# Altium schematic sheet INVERTER.SchDoc
size B; CompanyName: Microchip Technology Inc.; Organization: Microchip Technology; Address1: 2355 West Chandler Blvd.; Address2: Chandler, AZ  85224; Address4: USA; DocumentNumber: 2; SheetNumber: 2; SheetTotal: 3; SheetTitle: MOSFET DRIVER + INVERTER; Time: Time
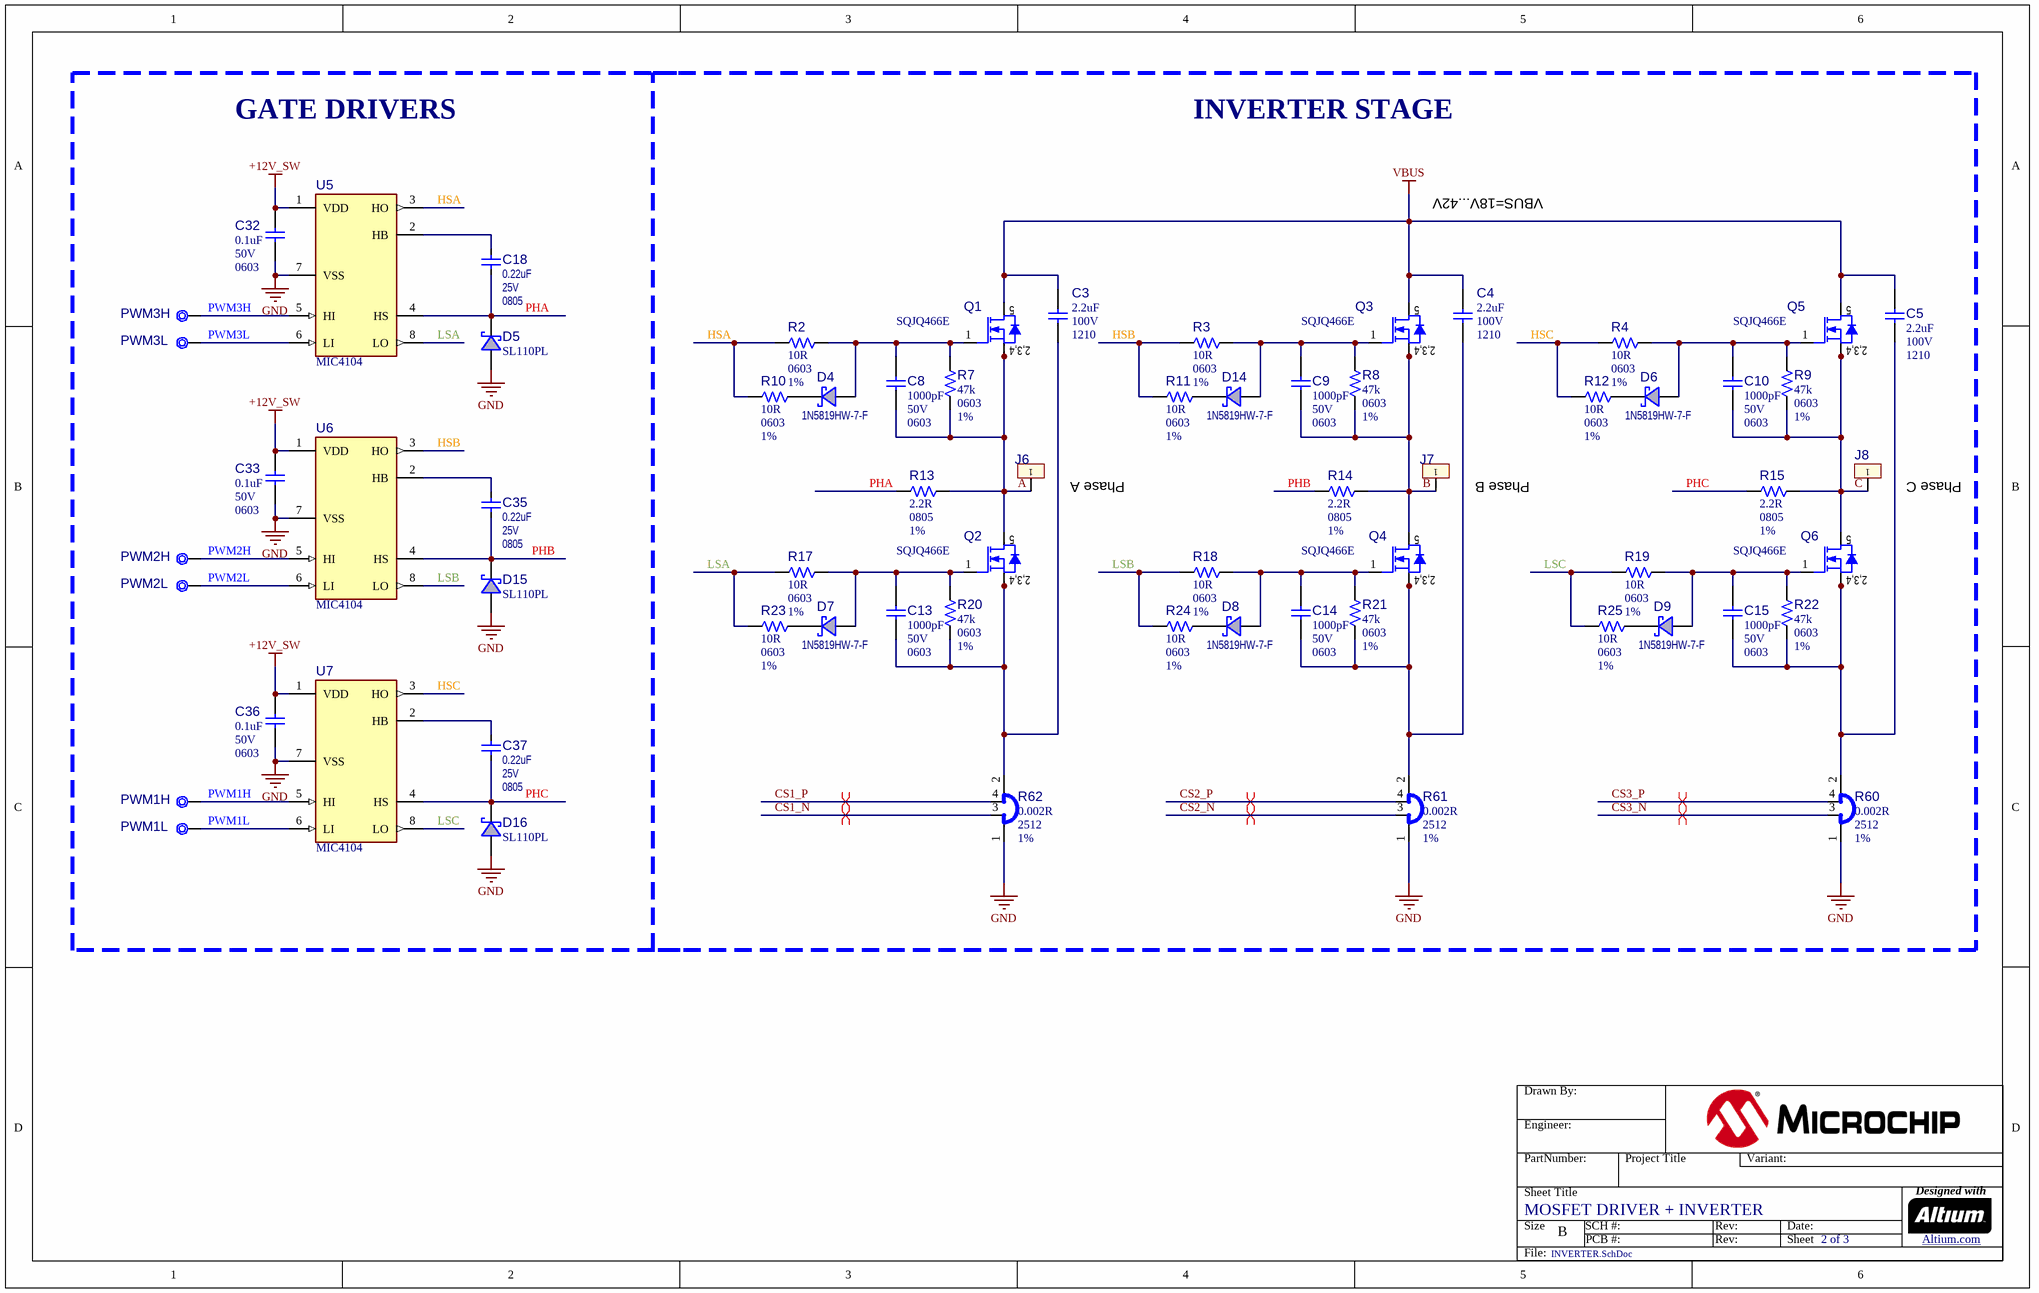
[diagram p0: INVERTER.SchDoc]

## Parts
?  (no value)  (graphical)
C3  value 2.2uF  Voltage: 100V  Package: 1210  [CAP_C_1210]  (hidden comment: Capacitor NP)
C4  value 2.2uF  Voltage: 100V  Package: 1210  [CAP_C_1210]  (hidden comment: Capacitor NP)
C5  value 2.2uF  Voltage: 100V  Package: 1210  [CAP_C_1210]  (hidden comment: Capacitor NP)
C8  value 1000pF  Voltage: 50V  Package: 0603  [CAP_C_0603]  (hidden comment: Capacitor NP)
C9  value 1000pF  Voltage: 50V  Package: 0603  [CAP_C_0603]  (hidden comment: Capacitor NP)
C10  value 1000pF  Voltage: 50V  Package: 0603  [CAP_C_0603]  (hidden comment: Capacitor NP)
C13  value 1000pF  Voltage: 50V  Package: 0603  [CAP_C_0603]  (hidden comment: Capacitor NP)
C14  value 1000pF  Voltage: 50V  Package: 0603  [CAP_C_0603]  (hidden comment: Capacitor NP)
C15  value 1000pF  Voltage: 50V  Package: 0603  [CAP_C_0603]  (hidden comment: Capacitor NP)
C18  value 0.22uF  Voltage: 25V  Package: 0805  [CAP_C_0805]  (hidden comment: Capacitor NP)
C32  value 0.1uF  Voltage: 50V  Package: 0603  [CAP_C_0603]  (hidden comment: Capacitor NP)
C33  value 0.1uF  Voltage: 50V  Package: 0603  [CAP_C_0603]  (hidden comment: Capacitor NP)
C35  value 0.22uF  Voltage: 25V  Package: 0805  [CAP_C_0805]  (hidden comment: Capacitor NP)
C36  value 0.1uF  Voltage: 50V  Package: 0603  [CAP_C_0603]  (hidden comment: Capacitor NP)
C37  value 0.22uF  Voltage: 25V  Package: 0805  [CAP_C_0805]  (hidden comment: Capacitor NP)
D4  value 1N5819HW-7-F  [SOD-123]  (hidden comment: Diode Schottky)
D5  value SL110PL  [SOD-123FL]  (hidden comment: Diode Schottky)
D6  value 1N5819HW-7-F  [SOD-123]  (hidden comment: Diode Schottky)
D7  value 1N5819HW-7-F  [SOD-123]  (hidden comment: Diode Schottky)
D8  value 1N5819HW-7-F  [SOD-123]  (hidden comment: Diode Schottky)
D9  value 1N5819HW-7-F  [SOD-123]  (hidden comment: Diode Schottky)
D14  value 1N5819HW-7-F  [SOD-123]  (hidden comment: Diode Schottky)
D15  value SL110PL  [SOD-123FL]  (hidden comment: Diode Schottky)
D16  value SL110PL  [SOD-123FL]  (hidden comment: Diode Schottky)
J6  Header 1x1  [CON_M_1x1_5.08_QC_TAB_SPADE_0.250_V]  (value not drawn)
J7  Header 1x1  [CON_M_1x1_5.08_QC_TAB_SPADE_0.250_V]  (value not drawn)
J8  Header 1x1  [CON_M_1x1_5.08_QC_TAB_SPADE_0.250_V]  (value not drawn)
PWM1H  Test Point No BOM  [TP_1.2x0.7]  (value not drawn)  (no BOM)
PWM1L  Test Point No BOM  [TP_1.2x0.7]  (value not drawn)  (no BOM)
PWM2H  Test Point No BOM  [TP_1.2x0.7]  (value not drawn)  (no BOM)
PWM2L  Test Point No BOM  [TP_1.2x0.7]  (value not drawn)  (no BOM)
PWM3H  Test Point No BOM  [TP_1.2x0.7]  (value not drawn)  (no BOM)
PWM3L  Test Point No BOM  [TP_1.2x0.7]  (value not drawn)  (no BOM)
Q1  value SQJQ466E  [PPAK_SO-8L_8x8_ALTERNATE]  (hidden comment: Transistor MOS-N GSSSD)
Q2  value SQJQ466E  [PPAK_SO-8L_8x8_ALTERNATE]  (hidden comment: Transistor MOS-N GSSSD)
Q3  value SQJQ466E  [PPAK_SO-8L_8x8_ALTERNATE]  (hidden comment: Transistor MOS-N GSSSD)
Q4  value SQJQ466E  [PPAK_SO-8L_8x8_ALTERNATE]  (hidden comment: Transistor MOS-N GSSSD)
Q5  value SQJQ466E  [PPAK_SO-8L_8x8_ALTERNATE]  (hidden comment: Transistor MOS-N GSSSD)
Q6  value SQJQ466E  [PPAK_SO-8L_8x8_ALTERNATE]  (hidden comment: Transistor MOS-N GSSSD)
R2  value 10R  Package: 0603  Tolerance: 1%  [RES_C_0603]  (hidden comment: Resistor)
R3  value 10R  Package: 0603  Tolerance: 1%  [RES_C_0603]  (hidden comment: Resistor)
R4  value 10R  Package: 0603  Tolerance: 1%  [RES_C_0603]  (hidden comment: Resistor)
R7  value 47k  Package: 0603  Tolerance: 1%  [RES_C_0603]  (hidden comment: Resistor)
R8  value 47k  Package: 0603  Tolerance: 1%  [RES_C_0603]  (hidden comment: Resistor)
R9  value 47k  Package: 0603  Tolerance: 1%  [RES_C_0603]  (hidden comment: Resistor)
R10  value 10R  Package: 0603  Tolerance: 1%  [RES_C_0603]  (hidden comment: Resistor)
R11  value 10R  Package: 0603  Tolerance: 1%  [RES_C_0603]  (hidden comment: Resistor)
R12  value 10R  Package: 0603  Tolerance: 1%  [RES_C_0603]  (hidden comment: Resistor)
R13  value 2.2R  Package: 0805  Tolerance: 1%  [RES_C_0805]  (hidden comment: Resistor)
R14  value 2.2R  Package: 0805  Tolerance: 1%  [RES_C_0805]  (hidden comment: Resistor)
R15  value 2.2R  Package: 0805  Tolerance: 1%  [RES_C_0805]  (hidden comment: Resistor)
R17  value 10R  Package: 0603  Tolerance: 1%  [RES_C_0603]  (hidden comment: Resistor)
R18  value 10R  Package: 0603  Tolerance: 1%  [RES_C_0603]  (hidden comment: Resistor)
R19  value 10R  Package: 0603  Tolerance: 1%  [RES_C_0603]  (hidden comment: Resistor)
R20  value 47k  Package: 0603  Tolerance: 1%  [RES_C_0603]  (hidden comment: Resistor)
R21  value 47k  Package: 0603  Tolerance: 1%  [RES_C_0603]  (hidden comment: Resistor)
R22  value 47k  Package: 0603  Tolerance: 1%  [RES_C_0603]  (hidden comment: Resistor)
R23  value 10R  Package: 0603  Tolerance: 1%  [RES_C_0603]  (hidden comment: Resistor)
R24  value 10R  Package: 0603  Tolerance: 1%  [RES_C_0603]  (hidden comment: Resistor)
R25  value 10R  Package: 0603  Tolerance: 1%  [RES_C_0603]  (hidden comment: Resistor)
R60  value 0.002R  Package: 2512  Tolerance: 1%  [RES_C_2512_SHUNT_Metal]  (hidden comment: Shunt 4 Pin)
R61  value 0.002R  Package: 2512  Tolerance: 1%  [RES_C_2512_SHUNT_Metal]  (hidden comment: Shunt 4 Pin)
R62  value 0.002R  Package: 2512  Tolerance: 1%  [RES_C_2512_SHUNT_Metal]  (hidden comment: Shunt 4 Pin)
U5  value MIC4104  [SOIC-8]  (hidden comment: MIC4104 SOIC-8)
U6  value MIC4104  [SOIC-8]  (hidden comment: MIC4104 SOIC-8)
U7  value MIC4104  [SOIC-8]  (hidden comment: MIC4104 SOIC-8)

## Blocks framed on the sheet
INVERTER STAGE: C3-C5 C8-C10 C13-C15 D4 D6-D9 D14 J6-J8 Q1-Q6 R2-R4 R7-R15 R17-R25 R60-R62

## Nets
+12V_SW: C32.2 C33.2 C36.2 U5.1(VDD) U6.1(VDD) U7.1(VDD)
GND: C32.1 C33.1 C36.1 D5.1(A) D15.1(A) D16.1(A) R60.1 R61.1 R62.1 U5.7(VSS) U6.7(VSS) U7.7(VSS)
VBUS: C3.2 C4.2 C5.2 Q1.5(D) Q3.5(D) Q5.5(D)
A: C8.1 J6.1 Q1.2(S) Q1.3(S) Q1.4(S) Q2.5(D) R7.1 R13.2
B: C9.1 J7.1 Q3.2(S) Q3.3(S) Q3.4(S) Q4.5(D) R8.1 R14.2
C: C10.1 J8.1 Q5.2(S) Q5.3(S) Q5.4(S) Q6.5(D) R9.1 R15.2
CS1_N: R62.3
CS1_P: R62.4
CS2_N: R61.3
CS2_P: R61.4
CS3_N: R60.3
CS3_P: R60.4
HSA: R2.1 R10.1 U5.3(HO)
HSB: R3.1 R11.1 U6.3(HO)
HSC: R4.1 R12.1 U7.3(HO)
LSA: R17.1 R23.1 U5.8(LO)
LSB: R18.1 R24.1 U6.8(LO)
LSC: R19.1 R25.1 U7.8(LO)
PHA: C18.1 D5.2(K) R13.1 U5.4(HS)
PHB: C35.1 D15.2(K) R14.1 U6.4(HS)
PHC: C37.1 D16.2(K) R15.1 U7.4(HS)
PWM1H: PWM1H.1 U7.5(HI)
PWM1L: PWM1L.1 U7.6(LI)
PWM2H: PWM2H.1 U6.5(HI)
PWM2L: PWM2L.1 U6.6(LI)
PWM3H: PWM3H.1 U5.5(HI)
PWM3L: PWM3L.1 U5.6(LI)
NetC3_1: C3.1 C13.1 Q2.2(S) Q2.3(S) Q2.4(S) R20.1 R62.2
NetC4_1: C4.1 C14.1 Q4.2(S) Q4.3(S) Q4.4(S) R21.1 R61.2
NetC5_1: C5.1 C15.1 Q6.2(S) Q6.3(S) Q6.4(S) R22.1 R60.2
NetC8_2: C8.2 D4.1(A) Q1.1(G) R2.2 R7.2
NetC9_2: C9.2 D14.1(A) Q3.1(G) R3.2 R8.2
NetC10_2: C10.2 D6.1(A) Q5.1(G) R4.2 R9.2
NetC13_2: C13.2 D7.1(A) Q2.1(G) R17.2 R20.2
NetC14_2: C14.2 D8.1(A) Q4.1(G) R18.2 R21.2
NetC15_2: C15.2 D9.1(A) Q6.1(G) R19.2 R22.2
NetC18_2: C18.2 U5.2(HB)
NetC35_2: C35.2 U6.2(HB)
NetC37_2: C37.2 U7.2(HB)
NetD4_2: D4.2(K) R10.2
NetD6_2: D6.2(K) R12.2
NetD7_2: D7.2(K) R23.2
NetD8_2: D8.2(K) R24.2
NetD9_2: D9.2(K) R25.2
NetD14_2: D14.2(K) R11.2

## Layout directives
differential pair: CS1_N, CS1_P, CS2_N, CS2_P, CS3_N, CS3_P

## Notes on the sheet
- GATE DRIVERS
- VBUS=18V...42V
- (near J6) Phase A
- (near J7) Phase B
- (near J8) Phase C
- Drawn By:
- Engineer:
- PartNumber:
- Project Title
- Variant:
- Sheet Title
- Size
- B
- SCH #:
- PCB #:
- Rev:
- Date:
- Sheet
- Designed with
- Altium.com <http://go.altium.com/MicrochipLandingPage_Evaluation.html>
- File:
- (in symbol TRA1472) 2,3,4

## Library data of the parts
? = Title Block B
C3-C5 = CAP1121: Capacitor; Manufacturer 1: AVX Corporation; Manufacturer Part Number 1: 12101C225KAT2A; Description_: CAP CER 2.2uF 100V 10% X7R SMD 1210; Dev Tools Status: Production; Tolerance: 10%; Temperature Coeffcient: X7R; Type: Ceramic; Owner: Mihai T(M91442); Populated: YES; MCHP-ID: CAP1121; Revision: 0; Symbol: Capacitor NP; Status: MCL Design; ComponentLink1URL: https://chn-vm-apps.microchip.com/mchprepo/parts/Datasheets/X7RDielectric.pdf; ComponentLink1Description: SVN Datasheet; ComponentLink2URL: C:\ALTIUM_WORK\00001_MCHP-CDB\Datasheets\X7RDielectric.pdf; ComponentLink2Description: Local Datasheet; ComponentLink3URL: C:\ALTIUM_WORK\00001_MCHP-CDB\Library\LibraryRefs\Capacitor NP.SchLib; ComponentLink3Description: Open Symbol; ComponentLink4URL: C:\ALTIUM_WORK\00001_MCHP-CDB\Library\Footprints\CAP_C_1210.PcbLib; ComponentLink4Description: Open Footprint; ComponentLink5Description: Open Footprint 2; ComponentLink6Description: Open Footprint 3; ComponentLink7Description: Open Footprint 4; Operating Temperature: -55C to +125C; Category: Capacitor; Manufacturer 2: KEMET; Manufacturer Part Number 2: C1210C225K1RACTU; Supplier 1: Digi-Key; Supplier Part Number 1: 478-7974-1-ND; Supplier 2: Digi-Key; Supplier Part Number 2: 399-5511-1-ND; Supplier 3: Farnell; Supplier Part Number 3: 1793832; Quantity Override: 1
C8-C10 C13-C15 = CAP2035: Manufacturer 1: TDK Corporation; Manufacturer Part Number 1: CGA3E2X7R1H102K080AA; Description_: CAP CER 1000pF 10% 50V X7R SMD 0603 AEC-Q200; Dev Tools Status: Design; Tolerance: 10%; Temperature Coeffcient: X7R; Type: Ceramic; Owner: Gabor Bihari; Populated: YES; MCHP-ID: CAP2035; Revision: 1; Symbol: Capacitor NP; Status: MCL Design; ComponentLink1URL: https://chn-vm-apps.microchip.com/mchprepo/parts/Datasheets/mlcc_automotive_general_en.pdf; ComponentLink1Description: SVN Datasheet; ComponentLink2URL: C:\ALTIUM_WORK\00001_MCHP-CDB\Datasheets\mlcc_automotive_general_en.pdf; ComponentLink2Description: Local Datasheet; ComponentLink3URL: C:\ALTIUM_WORK\00001_MCHP-CDB\Library\LibraryRefs\Capacitor NP.SchLib; ComponentLink3Description: Open Symbol; ComponentLink4URL: C:\ALTIUM_WORK\00001_MCHP-CDB\Library\Footprints\CAP_C_0603.PcbLib; ComponentLink4Description: Open Footprint; ComponentLink5Description: Open Footprint 2; ComponentLink6Description: Open Footprint 3; ComponentLink7Description: Open Footprint 4; Operating Temperature: -55°C - 125°C; Category: Capacitor; Supplier 1: Digi-Key; Supplier Part Number 1: 445-5659-1-ND; Quantity Override: 1
C18 C35 C37 = CAP0135: Manufacturer 1: Panasonic; Manufacturer Part Number 1: ECJ-2YB1E224K; Description_: CAP CER 0.22uF 25V 10% X7R SMD 0805; Dev Tools Status: Production; Tolerance: 10%; Temperature Coeffcient: X7R; Type: Ceramic; Populated: Yes; MCHP-ID: CAP0135; Revision: 1; Symbol: Capacitor NP; Status: MCL Design; ComponentLink1URL: https://chn-vm-apps.microchip.com/mchprepo/parts/Datasheets/general_B11.pdf; ComponentLink1Description: SVN Datasheet; ComponentLink2URL: C:\ALTIUM_WORK\00001_MCHP-CDB\Datasheets\general_B11.pdf; ComponentLink2Description: Local Datasheet; ComponentLink3URL: C:\ALTIUM_WORK\00001_MCHP-CDB\Library\LibraryRefs\Capacitor NP.SchLib; ComponentLink3Description: Open Symbol; ComponentLink4URL: C:\ALTIUM_WORK\00001_MCHP-CDB\Library\Footprints\CAP_C_0805.PcbLib; ComponentLink4Description: Open Footprint; ComponentLink5Description: Open Footprint 2; ComponentLink6Description: Open Footprint 3; ComponentLink7Description: Open Footprint 4; Operating Temperature: -55C to +125C; Category: Capacitor; Supplier 1: Digi-Key; Supplier Part Number 1: PCC1832CT-ND; Quantity Override: 1; Manufacturer 2: TDK; Manufacturer Part Number 2: C2012X7R1E224K; Supplier 2: Digi-Key; Supplier Part Number 2: 445-1352-1-ND
C32 C33 C36 = CAP2016: Capacitor; Manufacturer 1: AVX Corporation; Manufacturer Part Number 1: 06035C104K4Z4A; Description_: CAP CER 0.1uF 50V 10% X7R AEC-Q200 SMD 0603; Dev Tools Status: Design; Tolerance: 10%; Temperature Coeffcient: X7R; Type: Ceramic; Owner: Sam Charles; Populated: YES; MCHP-ID: CAP2016; Revision: A; Symbol: Capacitor NP; Status: MCL Design; ComponentLink1URL: https://chn-vm-apps.microchip.com/mchprepo/parts/Datasheets/FlexitermMLCC.pdf; ComponentLink1Description: SVN Datasheet; ComponentLink2URL: C:\ALTIUM_WORK\00001_MCHP-CDB\Datasheets\FlexitermMLCC.pdf; ComponentLink2Description: Local Datasheet; ComponentLink3URL: C:\ALTIUM_WORK\00001_MCHP-CDB\Library\LibraryRefs\Capacitor NP.SchLib; ComponentLink3Description: Open Symbol; ComponentLink4URL: C:\ALTIUM_WORK\00001_MCHP-CDB\Library\Footprints\CAP_C_0603.PcbLib; ComponentLink4Description: Open Footprint; ComponentLink5Description: Open Footprint 2; ComponentLink6Description: Open Footprint 3; ComponentLink7Description: Open Footprint 4; Operating Temperature: -55°C ~ 125°C; Category: Capacitor; Supplier 1: Digi-Key; Supplier Part Number 1: 478-10679-1-ND; Quantity Override: 1
D4 D6-D9 D14 = DIODE1233: DIO SCTKY RB160M-60TR 550mV 1A 60V SMD SOD-123F; Manufacturer 1: Diodes Incorporated; Description_: DIODE SCTKY 1N5819HW-7-F 450mV 1A 40V SMD SOD-123; Dev Tools Status: Design; Type: Schottky Single; Power: 450mW; Reverse Current: 1mA; Reverse Recovery Time: 500ns; Reverse Voltage: 40V; Owner: Sorin Stanoaia; Populated: YES; MCHP-ID: DIODE1233; Revision: A; Symbol: Diode Schottky; Status: MCL Design; Package: SOD-123; ComponentLink1URL: https://chn-vm-apps.microchip.com/mchprepo/parts/Datasheets/ds30217.pdf; ComponentLink1Description: SVN Datasheet; ComponentLink2URL: C:\ALTIUM_WORK\00001_MCHP-CDB\Datasheets\ds30217.pdf; ComponentLink2Description: Local Datasheet; ComponentLink3URL: C:\ALTIUM_WORK\00001_MCHP-CDB\Library\LibraryRefs\Diode Schottky.SchLib; ComponentLink3Description: Open Symbol; ComponentLink4URL: C:\ALTIUM_WORK\00001_MCHP-CDB\Library\Footprints\SOD-123.PcbLib; ComponentLink4Description: Open Footprint; ComponentLink5Description: Open Footprint 2; ComponentLink6Description: Open Footprint 3; ComponentLink7Description: Open Footprint 4; Operating Temperature: -65C to +125C; Category: Diode; Forward Current: 1A; Manufacturer Part Number 1: 1N5819HW-7-F; Supplier 1: Digi-Key; Supplier Part Number 1: 1N5819HW-FDICT-ND; Quantity Override: 1
D5 D15 D16 = DIODE1296: DIO SCTKY RB160M-60TR 550mV 1A 60V SMD SOD-123F; Manufacturer 1: Micro Commercial Co; Manufacturer Part Number 1: SL110PL-TP; Description_: DIO SCTKY  SL110PL-TP 600mV 1A 100V SOD-123FL; Dev Tools Status: Design; Type: Schottky Single; Reverse Recovery Time: 500ns; Reverse Voltage: 100V; Owner: Tad Ahlvers; Populated: YES; MCHP-ID: DIODE1296; Revision: A; Symbol: Diode Schottky; Status: MCL Design; Package: SOD-123FL; ComponentLink1URL: https://chn-vm-apps.microchip.com/mchprepo/parts/Datasheets/SL14PL-SL110PL(SOD-123FL)-A.pdf; ComponentLink1Description: SVN Datasheet; ComponentLink2URL: C:\ALTIUM_WORK\00001_MCHP-CDB\Datasheets\SL14PL-SL110PL(SOD-123FL)-A.pdf; ComponentLink2Description: Local Datasheet; ComponentLink3URL: C:\ALTIUM_WORK\00001_MCHP-CDB\Library\LibraryRefs\Diode Schottky.SchLib; ComponentLink3Description: Open Symbol; ComponentLink4URL: C:\ALTIUM_WORK\00001_MCHP-CDB\Library\Footprints\SOD-123FL.PcbLib; ComponentLink4Description: Open Footprint; ComponentLink5Description: Open Footprint 2; ComponentLink6Description: Open Footprint 3; ComponentLink7Description: Open Footprint 4; Operating Temperature: -55C to +150C; Category: Diode; Forward Current: 1A; Supplier 1: Digi-Key; Supplier Part Number 1: SL110PL-TPMSCT-ND; Quantity Override: 1
J6-J8 = CON2208: CON HDR-2.54 Male 1x1 Gold 5.97MH TH VERT; Manufacturer 1: TE Connectivity AMP Connectors; Manufacturer Part Number 1: 1-726386-2; Value: TERMINAL 1x1; Description_: CON CONTACT QC TAB 0.250 Male 1x1 TH VERT; Dev Tools Status: Design; Owner: Octavian Stroe; Populated: YES; MCHP-ID: CON2208; Revision: A; Symbol: Header 1x1; Status: MCL Design; ComponentLink1URL: https://chn-vm-apps.microchip.com/mchprepo/parts/Datasheets/ENG_CD_726386_G1.pdf; ComponentLink1Description: SVN Datasheet; ComponentLink2URL: C:\ALTIUM_WORK\00001_MCHP-CDB\Datasheets\ENG_CD_726386_G1.pdf; ComponentLink2Description: Local Datasheet; ComponentLink3URL: C:\ALTIUM_WORK\00001_MCHP-CDB\Library\LibraryRefs\Header 1x1.SchLib; ComponentLink3Description: Open Symbol; ComponentLink4URL: C:\ALTIUM_WORK\00001_MCHP-CDB\Library\Footprints\CON_M_1x1_5.08_QC_TAB_SPADE_0.250_V.PcbLib; ComponentLink4Description: Open Footprint; ComponentLink5Description: Open Footprint 2; ComponentLink6Description: Open Footprint 3; ComponentLink7Description: Open Footprint 4; Type: Contact; Category: Connector; Supplier 1: Digi-Key; Supplier Part Number 1: A122560-ND; Quantity Override: 1
PWM1H PWM1L PWM2H PWM2L PWM3H PWM3L = CON1128: Test Point; Value: TP PAD PCB 1.2x0.7; Description_: CON TP PAD PCB 1.2x0.7 TH; Dev Tools Status: Production; Owner: Bogdan P (M91398); Populated: Yes; MCHP-ID: CON1128; Revision: 0; Status: MCL Design; ComponentLink1Description: SVN Datasheet; Type: Test Point; Category: Connector; Quantity Override: 1; ComponentLink2Description: Local Datasheet; ComponentLink3Description: Open Symbol; ComponentLink3URL: C:\ALTIUM_WORK\00001_MCHP-CDB\Library\LibraryRefs\Test Point No BOM.SchLib; ComponentLink4Description: Open Footprint; ComponentLink4URL: C:\ALTIUM_WORK\00001_MCHP-CDB\Library\Footprints\TP_1.2x0.7.PcbLib; ComponentLink5Description: Open Footprint 2; ComponentLink6Description: Open Footprint 3; ComponentLink7Description: Open Footprint 4; Symbol: Test Point No BOM
Q1-Q6 = TRA1472: Transistor MOS; Manufacturer 1: Vishay Siliconix; Manufacturer Part Number 1: SQJQ466E-T1_GE3; Description_: TRANS FET N-CH SQJQ466E 60V 200A PowerPAK SO-8L AEC-Q101; Dev Tools Status: Design; Type: FET; Current: 200A; Drain to Source Voltage: 60V; Gate to Source Voltage: 20V; Power: 150W; Owner: Octavian Stroe; Populated: YES; MCHP-ID: TRA1472; Revision: 1; Symbol: Transistor MOS-N GSSSD; Status: MCL Design; Package: PowerPAK SO-8L; ComponentLink1URL: https://chn-vm-apps.microchip.com/mchprepo/parts/Datasheets/sqjq466e.pdf; ComponentLink1Description: SVN Datasheet; ComponentLink2URL: C:\ALTIUM_WORK\00001_MCHP-CDB\Datasheets\sqjq466e.pdf; ComponentLink2Description: Local Datasheet; ComponentLink3URL: C:\ALTIUM_WORK\00001_MCHP-CDB\Library\LibraryRefs\Transistor MOS-N GSSSD.SchLib; ComponentLink3Description: Open Symbol; ComponentLink4URL: C:\ALTIUM_WORK\00001_MCHP-CDB\Library\Footprints\PPAK_SO-8L_8x8.PcbLib; ComponentLink4Description: Open Footprint; ComponentLink5Description: Open Footprint 2; ComponentLink6Description: Open Footprint 3; ComponentLink7Description: Open Footprint 4; Category: Transistor; Voltage: 60V; Supplier 1: Digi-Key; Supplier Part Number 1: SQJQ466E-T1_GE3CT-ND; Quantity Override: 1; ComponentLink7URL: C:\ALTIUM_WORK\00001_MCHP-CDB\Library\Footprints\PPAK_SO-8L_8x8_ALTERNATE.PcbLib; Operating Temperature: -55C to +175C
R2-R4 R10-R12 R23-R25 = RSMT0456: Manufacturer 1: Panasonic; Manufacturer Part Number 1: ERJ-3EKF10R0V; Description_: RES TKF 10R 1% 1/10W SMD 0603; Dev Tools Status: Production; Voltage: 75V; Temperature Coeffcient: 100ppm/C; Power: 1/10W; Populated: Yes; MCHP-ID: RSMT0456; Revision: 2; Symbol: Resistor; Status: MCL Design; ComponentLink1URL: https://chn-vm-apps.microchip.com/mchprepo/parts/Datasheets/AOA0000CE2.pdf; ComponentLink1Description: SVN Datasheet; ComponentLink2URL: C:\ALTIUM_WORK\00001_MCHP-CDB\Datasheets\AOA0000CE2.pdf; ComponentLink2Description: Local Datasheet; ComponentLink3URL: C:\ALTIUM_WORK\00001_MCHP-CDB\Library\LibraryRefs\Resistor.SchLib; ComponentLink3Description: Open Symbol; ComponentLink4URL: C:\ALTIUM_WORK\00001_MCHP-CDB\Library\Footprints\RES_C_0603.PcbLib; ComponentLink4Description: Open Footprint; ComponentLink5Description: Open Footprint 2; ComponentLink6Description: Open Footprint 3; ComponentLink7Description: Open Footprint 4; Operating Temperature: -55C to +155C; Category: Resistor; Type: RES SMD; Composition: TKF; Manufacturer 2: Yageo; Manufacturer Part Number 2: RC0603FR-0710RL; Manufacturer 3: SET; Manufacturer Part Number 3: RMCF1/1610.01%TR; Supplier 1: Digi-Key; Supplier Part Number 1: P10.0HTR-ND; Supplier 2: Digi-Key; Supplier Part Number 2: 311-10.0HRCT-ND; Supplier 3: SET; Supplier Part Number 3: RMCF1/1610.01%TR; Quantity Override: 1
R7-R9 R20-R22 = RES1183: Manufacturer 1: Panasonic; Manufacturer Part Number 1: ERJ-3EKF4702V; Description_: RES TKF 47k 1% 1/10W SMD 0603; Dev Tools Status: Production; Voltage: 75V; Temperature Coeffcient: 100ppm/C; Power: 1/10W; Populated: YES; Owner: Adrian M (M91404); MCHP-ID: RES1183; Revision: 0; Symbol: Resistor; Status: MCL Design; ComponentLink1URL: https://chn-vm-apps.microchip.com/mchprepo/parts/Datasheets/AOA0000CE2.pdf; ComponentLink1Description: SVN Datasheet; ComponentLink2URL: C:\ALTIUM_WORK\00001_MCHP-CDB\Datasheets\AOA0000CE2.pdf; ComponentLink2Description: Local Datasheet; ComponentLink3URL: C:\ALTIUM_WORK\00001_MCHP-CDB\Library\LibraryRefs\Resistor.SchLib; ComponentLink3Description: Open Symbol; ComponentLink4URL: C:\ALTIUM_WORK\00001_MCHP-CDB\Library\Footprints\RES_C_0603.PcbLib; ComponentLink4Description: Open Footprint; ComponentLink5Description: Open Footprint 2; ComponentLink6Description: Open Footprint 3; ComponentLink7Description: Open Footprint 4; Operating Temperature: -55C to +155C; Category: Resistor; Type: RES SMD; Composition: TKF; Supplier 1: Digi-Key; Supplier Part Number 1: P47.0KHCT-ND; Quantity Override: 1
R13-R15 = RES2048: Manufacturer 1: Vishay Dale; Manufacturer Part Number 1: CRCW08052R20FKEA; Description_: RES TKF 2.2R 1% 1/8W SMD 0805 AEC-Q200; Dev Tools Status: Production; Voltage: 150V; Temperature Coeffcient: 100ppm/C; Power: 1/8W; Owner: Cristian Papuc; Populated: YES; MCHP-ID: RES2048; Revision: 1; Symbol: Resistor; Status: MCL Design; ComponentLink1URL: https://chn-vm-apps.microchip.com/mchprepo/parts/Datasheets/dcrcwe3.pdf; ComponentLink1Description: SVN Datasheet; ComponentLink2URL: C:\ALTIUM_WORK\00001_MCHP-CDB\Datasheets\dcrcwe3.pdf; ComponentLink2Description: Local Datasheet; ComponentLink3URL: C:\ALTIUM_WORK\00001_MCHP-CDB\Library\LibraryRefs\Resistor.SchLib; ComponentLink3Description: Open Symbol; ComponentLink4URL: C:\ALTIUM_WORK\00001_MCHP-CDB\Library\Footprints\RES_C_0805.PcbLib; ComponentLink4Description: Open Footprint; ComponentLink5Description: Open Footprint 2; ComponentLink6Description: Open Footprint 3; ComponentLink7Description: Open Footprint 4; Operating Temperature: -55C to +155C; Category: Resistor; Type: RES SMD; Composition: TKF; Supplier 1: Digi-Key; Supplier Part Number 1: 541-2.20CCCT-ND; Quantity Override: 1
R17-R19 = RSMT0456: Manufacturer 1: Panasonic; Manufacturer Part Number 1: ERJ-3EKF10R0V; Description_: RES TKF 10R 1% 1/10W SMD 0603; Dev Tools Status: Production; Temperature Coeffcient: 100ppm/C; Populated: Yes; Voltage: 75V; Power: 1/10W; MCHP-ID: RSMT0456; Revision: 2; Symbol: Resistor; Status: MCL Design; ComponentLink1URL: https://chn-vm-apps.microchip.com/mchprepo/parts/Datasheets/AOA0000CE2.pdf; ComponentLink1Description: SVN Datasheet; ComponentLink2URL: C:\ALTIUM_WORK\00001_MCHP-CDB\Datasheets\AOA0000CE2.pdf; ComponentLink2Description: Local Datasheet; ComponentLink3URL: C:\ALTIUM_WORK\00001_MCHP-CDB\Library\LibraryRefs\Resistor.SchLib; ComponentLink3Description: Open Symbol; ComponentLink4URL: C:\ALTIUM_WORK\00001_MCHP-CDB\Library\Footprints\RES_C_0603.PcbLib; ComponentLink4Description: Open Footprint; ComponentLink5Description: Open Footprint 2; ComponentLink6Description: Open Footprint 3; ComponentLink7Description: Open Footprint 4; Operating Temperature: -55C to +155C; Category: Resistor; Type: RES SMD; Composition: TKF; Supplier 1: Digi-Key; Supplier Part Number 1: P10.0HTR-ND; Quantity Override: 1; Manufacturer 2: Yageo; Manufacturer Part Number 2: RC0603FR-0710RL; Manufacturer 3: SET; Manufacturer Part Number 3: RMCF1/1610.01%TR; Supplier 2: Digi-Key; Supplier Part Number 2: 311-10.0HRCT-ND; Supplier 3: SET; Supplier Part Number 3: RMCF1/1610.01%TR
R60-R62 = RES2539: Shunt; Manufacturer 1: Vishay Dale; Manufacturer Part Number 1: WSLF25122L000FEA; Description_: RES SHUNT ME 0.002R 1% 5W AEC-Q200 SMD 2512; Dev Tools Status: Design; Temperature Coeffcient: 70ppm/C; Power: 5W; Owner: Octavian Stroe; Populated: YES; MCHP-ID: RES2539; Revision: B; Symbol: Shunt 4 Pin; Status: MCL Design; ComponentLink1URL: https://chn-vm-apps.microchip.com/mchprepo/parts/Datasheets/wslf.pdf; ComponentLink1Description: SVN Datasheet; ComponentLink2URL: C:\ALTIUM_WORK\00001_MCHP-CDB\Datasheets\wslf.pdf; ComponentLink2Description: Local Datasheet; ComponentLink3URL: C:\ALTIUM_WORK\00001_MCHP-CDB\Library\LibraryRefs\Shunt 4 Pin.SchLib; ComponentLink3Description: Open Symbol; ComponentLink4URL: C:\ALTIUM_WORK\00001_MCHP-CDB\Library\Footprints\RES_C_2512_SHUNT_Metal.PcbLib; ComponentLink4Description: Open Footprint; ComponentLink5Description: Open Footprint 2; ComponentLink6Description: Open Footprint 3; ComponentLink7Description: Open Footprint 4; Operating Temperature: -65C to +170C; Category: Resistor; Type: Shunt; Composition: Metal Element; Supplier 1: Digi-Key; Supplier Part Number 1: 541-3126-1-ND; Quantity Override: 1
U5-U7 = MIC6432: MOSFET DRIVER; Manufacturer 1: Micrel Inc; Manufacturer Part Number 1: MIC4104YM; Description_: MCHP ANALOG FET DRIVER Dual-Non-Inverting MIC4104 SOIC-8; MAPS Description: 100V HalfBridge MOSFET Driver 3/2A SOURCE/SINK CURRENT TTL INPUT; Dev Tools Status: Design; Owner: Ed Kennedy; MPC: 2780143BXE01; LeadContent: Pb-FREE; PackingMedia: TUBE; Stage: REL; LeadCount: 8; PackageWidth: 3.90mm(.150in); ForceMinOrderQtyMult: False; MinOrderQty: 1; TempRange: -40C to +125C; tblDeviceFamilyID: 7802; PeakOutputCurrent: 3.0/2.0; Populated: YES; MCHP-ID: MIC6432; Symbol: MIC4104 SOIC-8; Type: FET Driver; Status: MCL Design; Revision: A; Category: MCHP-Analog; ComponentLink1URL: http://www.microchip.com/wwwproducts/MIC4104; ComponentLink1Description: SVN Datasheet; ComponentLink2Description: Local Datasheet; ComponentLink3URL: C:\ALTIUM_WORK\00001_MCHP-CDB\Library\LibraryRefs\MIC4104 SOIC-8.SchLib; ComponentLink3Description: Open Symbol; ComponentLink4URL: C:\ALTIUM_WORK\00001_MCHP-CDB\Library\Footprints\SOIC-8.PcbLib; ComponentLink4Description: Open Footprint; ComponentLink5Description: Open Footprint 2; ComponentLink6Description: Open Footprint 3; ComponentLink7Description: Open Footprint 4; Supplier 1: Digi-Key; Supplier Part Number 1: 576-1590-ND; IntroductionDate: 2007-01-08; PackageType: SOIC; Quantity Override: 1; ComponentLink2URL: C:\ALTIUM_WORK\00001_MCHP-CDB\Datasheets\mic4103-4.pdf